# EAGLE schematic BSPD_rev11_clean (EAGLE 9.6.2)
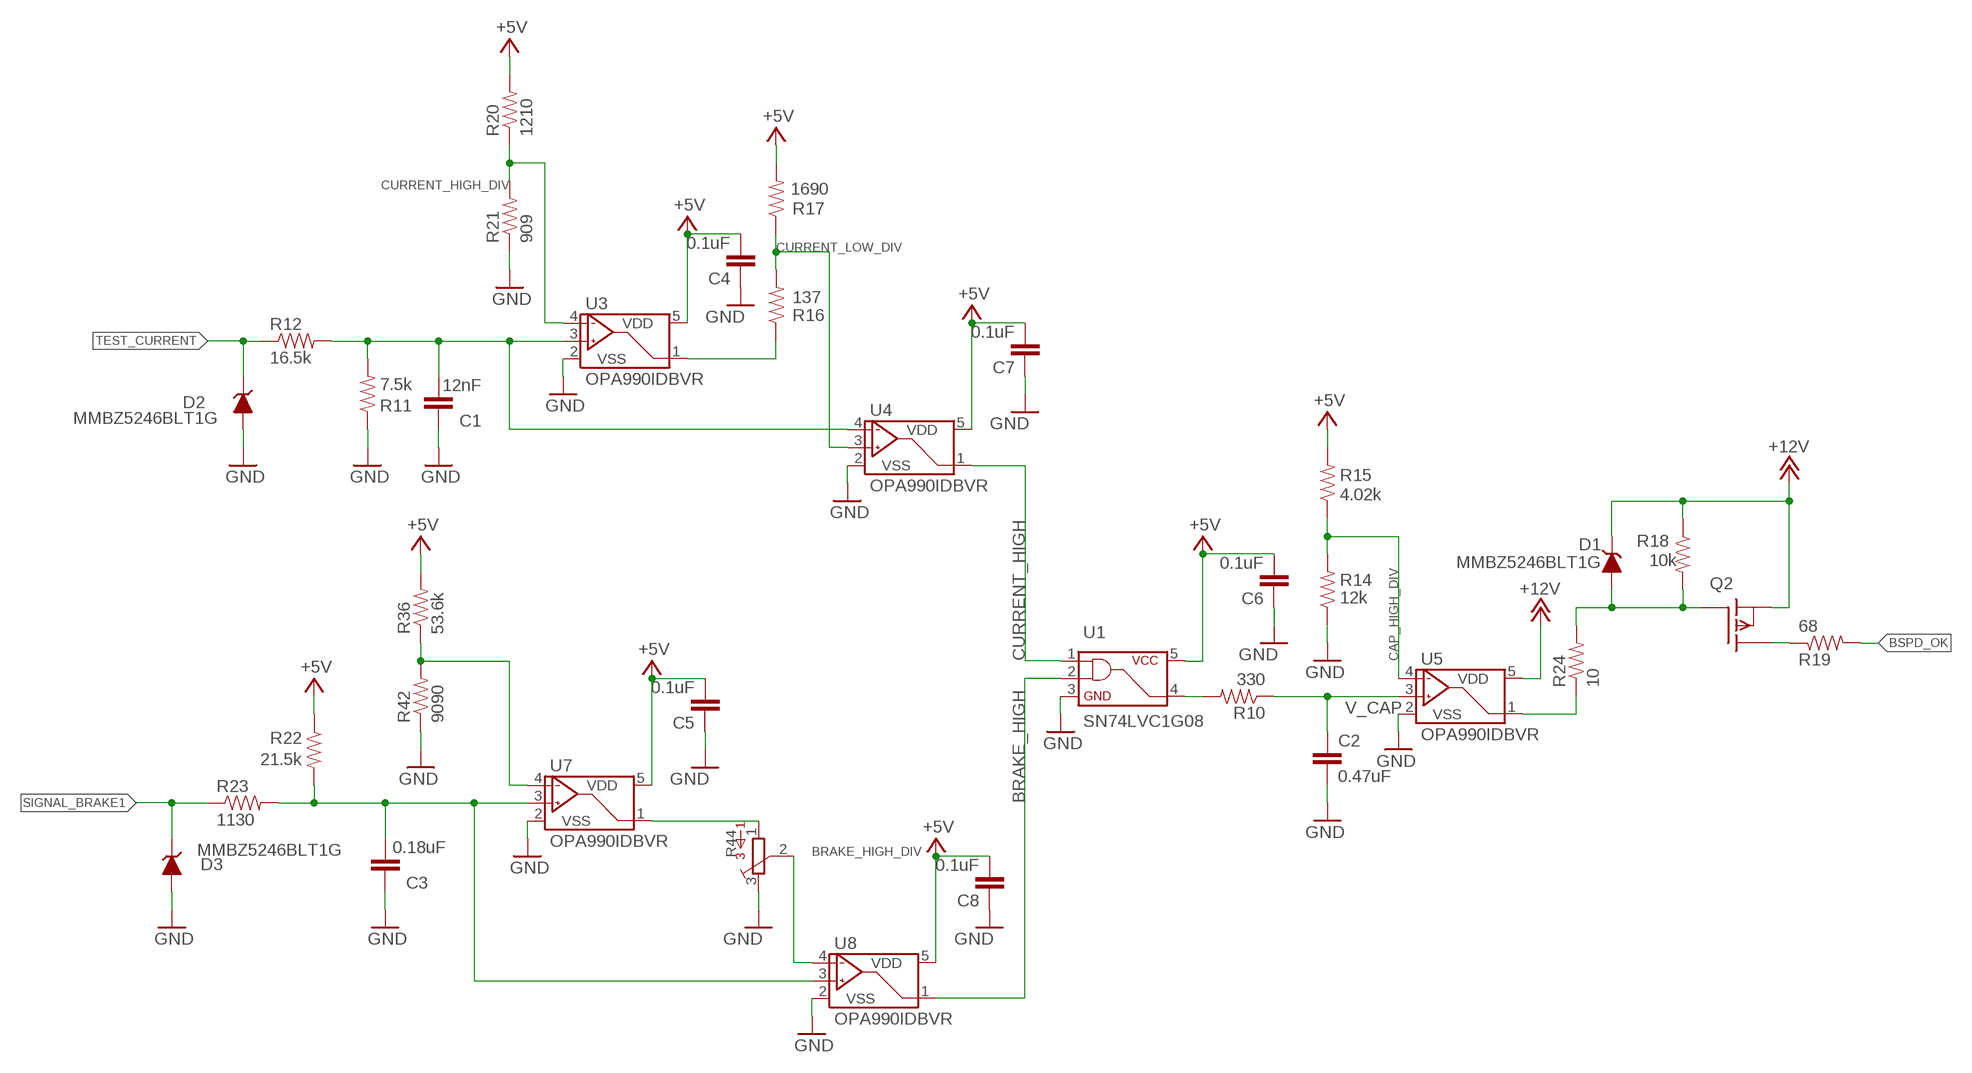
[diagram p0: schematic, sheet 1]

## Parts
C1  12nF  CAP0603-CAP  [0603-CAP]
C2  0.47uF  CAP0603-CAP  [0603-CAP]
C3  0.18uF  CAP0603-CAP  [0603-CAP]
C4  0.1uF  CAP0603-CAP  [0603-CAP]
C5  0.1uF  CAP0603-CAP  [0603-CAP]
C6  0.1uF  CAP0603-CAP  [0603-CAP]
C7  0.1uF  CAP0603-CAP  [0603-CAP]
C8  0.1uF  CAP0603-CAP  [0603-CAP]
D1  MMBZ5246BLT1G  DIODE_ZENER  [SOT23]
D2  MMBZ5246BLT1G  DIODE_ZENER  [SOT23]
D3  MMBZ5246BLT1G  DIODE_ZENER  [SOT23]
Q2  P-CHANNEL_MOSFET_DMP3099L-7  [SOT23]
R10  330  RESISTOR0603  [0603-RES]
R11  7.5k  RESISTOR0603  [0603-RES]
R12  16.5k  RESISTOR0603  [0603-RES]
R14  12k  RESISTOR0603  [0603-RES]
R15  4.02k  RESISTOR0603  [0603-RES]
R16  137  RESISTOR0603  [0603-RES]
R17  1690  RESISTOR0603  [0603-RES]
R18  10k  RESISTOR0603  [0603-RES]
R19  68  RESISTOR0603  [0603-RES]
R20  1210  RESISTOR0603  [0603-RES]
R21  909  RESISTOR0603  [0603-RES]
R22  21.5k  RESISTOR0603  [0603-RES]
R23  1130  RESISTOR0603  [0603-RES]
R24  10  RESISTOR0603  [0603-RES]
R36  53.6k  RESISTOR0603  [0603-RES]
R42  9090  RESISTOR0603  [0603-RES]
R44  TRIMPOT_3296C  [TRIMPOT_3296]
U1  SN74LVC1G08  [SOT-23-5]
U3  OPA990IDBVR  [SOT-23-5]
U4  OPA990IDBVR  [SOT-23-5]
U5  OPA990IDBVR  [SOT-23-5]
U7  OPA990IDBVR  [SOT-23-5]
U8  OPA990IDBVR  [SOT-23-5]

## Nets
+5V: C4.2 C5.2 C6.2 C7.2 C8.2 R15.2 R17.2 R20.2 R22.1 R36.2 U1.5 U3.5(VDD) U4.5(VDD) U7.5(VDD) U8.5(VDD)
+12V: D1.3(C) Q2.2(S) R18.1 U5.5(VDD)
BRAKE_HIGH: U1.2 U8.1(VOUT)
BRAKE_HIGH_DIV: R44.2 U8.4(VIN-)
BSPD_OK: R19.2
CAP_HIGH_DIV: R14.2 R15.1 U5.4(VIN-)
CURRENT_HIGH: U1.1 U4.1(VOUT)
CURRENT_HIGH_DIV: R20.1 R21.2 U3.4(VIN-)
CURRENT_LOW_DIV: R16.2 R17.1 U4.3(VIN+)
GND: C1.1 C2.2 C3.1 C4.1 C5.1 C6.1 C7.1 C8.1 D2.1(A) D3.1(A) R11.1 R14.1 R21.1 R42.1 R44.3 U1.3 U3.2(VSS) U4.2(VSS) U5.2(VSS) U7.2(VSS) U8.2(VSS)
N$6: R10.2 U1.4
N$7: C1.2 R11.2 R12.2 U3.3(VIN+) U4.4(VIN-)
N$8: D1.1(A) Q2.1(G) R18.2 R24.2
N$9: Q2.3(D) R19.1
N$10: R36.1 R42.2 U7.4(VIN-)
N$11: C3.2 R22.2 R23.2 U7.3(VIN+) U8.3(VIN+)
N$12: R16.1 U3.1(VOUT)
N$14: R44.1 U7.1(VOUT)
N$16: R24.1 U5.1(VOUT)
SIGNAL_BRAKE1: D3.3(C) R23.1
TEST_CURRENT: D2.3(C) R12.1
V_CAP: C2.1 R10.1 U5.3(VIN+)

## Library data of the parts
C1-C8 = HyTechDevices:CAP: Capacitor Standard 0603 ceramic capacitor, and 0.1" leaded capacitor.
D1-D3 = HyTechDevices:DIODE_ZENER: ZENER DIODE
Q2 = HyTechDevices:P-CHANNEL_MOSFET_DMP3099L-7: Diodes Incorporated P-Channel Enhancement Mode MOSFET Datasheet <http://www.mouser.com/ds/2/115/DMP3099L-266220.pdf>
R10-R12 R14-R24 R36 R42 = HyTechDevices:RESISTOR: Resistor Basic schematic elements and footprints for 0603, 1206, and PTH resistors.
R44 = HyTechDevices:TRIMPOT_3296: 3296 Series 3/8" Square Trimmer Source <https://github.com/chiengineer/Eagle-Libraries/blob/master/Potentiometers/bourns.lbr>
U1 = HyTechDevices:SN74LVC1G08: TI SN74LVC1G08 SINGLE 2-INPUT POSITIVE-AND GATE Datasheet <http://www.ti.com/lit/ds/sces556f/sces556f.pdf>
U3-U5 U7 U8 = HyTechDevices:OPA990IDBVR: TI OPA990 20V Op-Amp Comparator Datasheet <https://www.ti.com/lit/ds/symlink/opa990.pdf>